# Altium schematic sheet filtering-optical.SchDoc: FILTERING-OPTICAL
size A4; DrawnBy: Dylan Vogel; Organization: UTAT SS; DocumentNumber: 5; Revision: 1; SheetNumber: 5; SheetTotal: 7
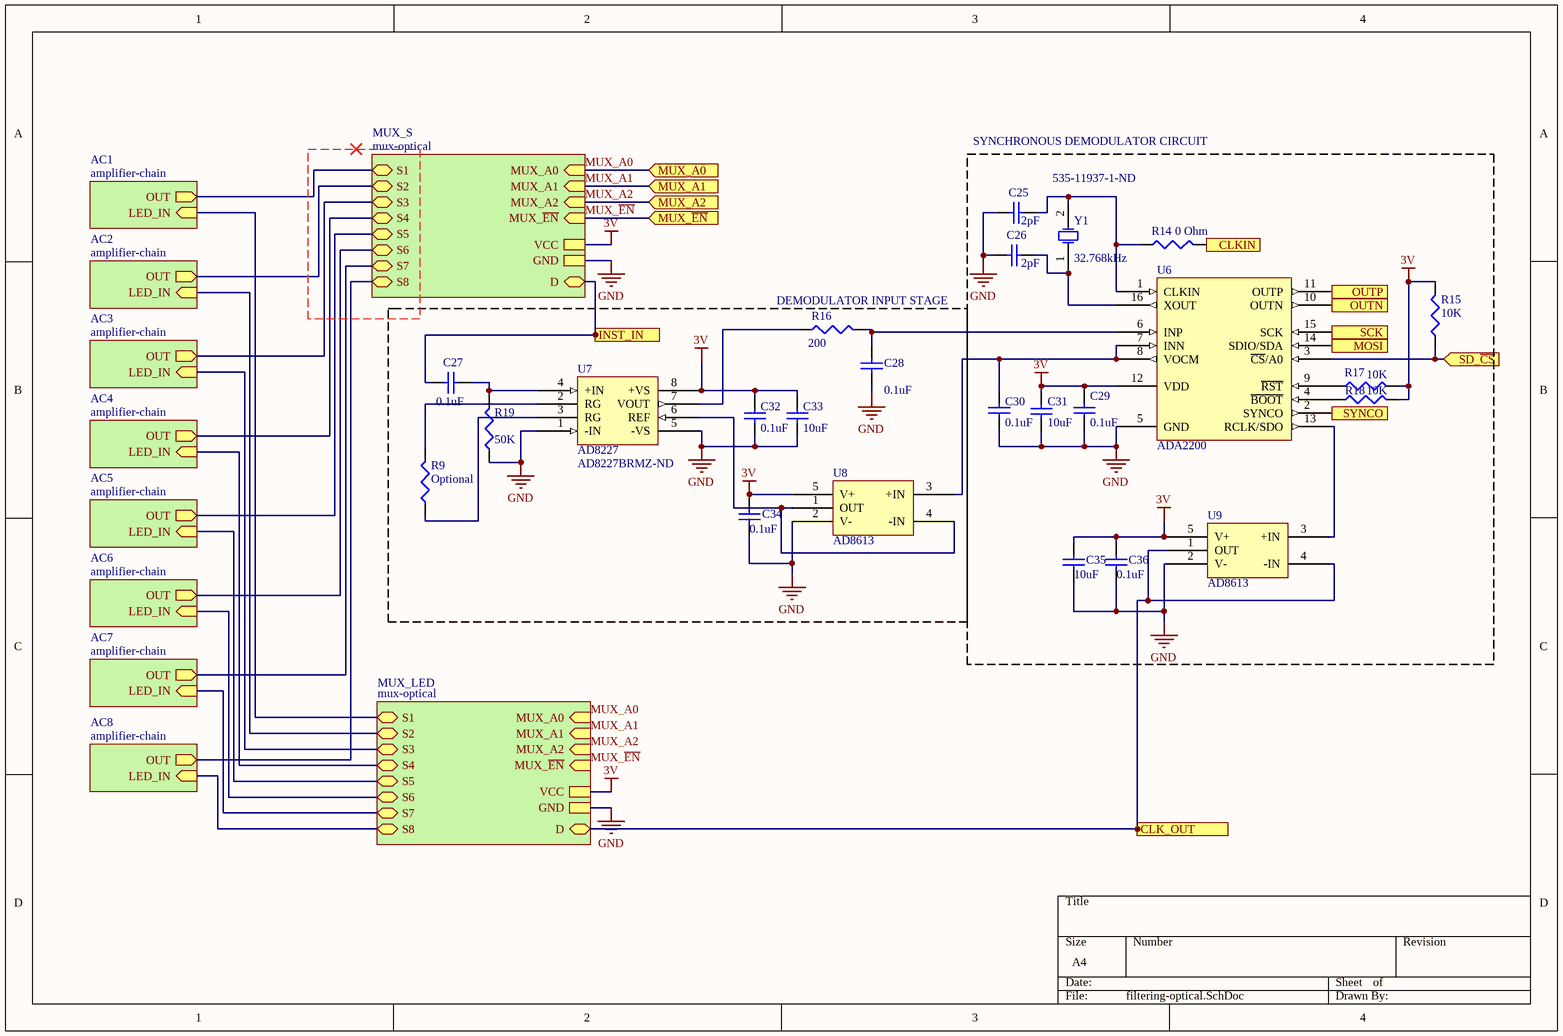
[diagram p0: filtering-optical.SchDoc]

## Parts
C25  2pF  [0402]
C26  2pF  [0402]
C27  0.1uF  [0402]
C28  0.1uF  [0402]
C29  0.1uF  [0402]
C30  0.1uF  [0402]
C31  10uF  [1608[0603]]
C32  0.1uF  [0402]
C33  10uF  [1608[0603]]
C34  0.1uF  [0402]
C35  10uF  [1608[0603]]
C36  0.1uF  [0402]
R9  Optional  [0402]
R14  0 Ohm  [0402]
R15  10K  [0402]
R16  200  [0402]
R17  10K  [0402]
R18  10K  [0402]
R19  50K  [0402]
U6  ADA2200  [SSOP16_N]
U7  AD8227  Supplier Part Number 1: AD8227BRMZ-ND  [SOP8-65P300X300-8N]
U8  AD8613  [SOP-65P200X125-5N]
U9  AD8613  [SOP-65P200X125-5N]
Y1  32.768kHz  Supplier Part Number: 535-11937-1-ND  [ABS07-120-32.768]

## Blocks framed on the sheet
SYNCHRONOUS DEMODULATOR CIRCUIT: C25 C26 C29-C31 C35 C36 R14 R15 R17 R18 U6 U9 Y1
DEMODULATOR INPUT STAGE: C27 C28 C32-C34 R9 R16 R19 U7 U8

## Sub-sheets
AC1 = amplifier-chain: OUT (out), LED_IN (in)
AC2 = amplifier-chain: OUT (out), LED_IN (in)
AC3 = amplifier-chain: OUT (out), LED_IN (in)
AC4 = amplifier-chain: OUT (out), LED_IN (in)
AC5 = amplifier-chain: OUT (out), LED_IN (in)
AC6 = amplifier-chain: OUT (out), LED_IN (in)
AC7 = amplifier-chain: OUT (out), LED_IN (in)
AC8 = amplifier-chain: OUT (out), LED_IN (in)
MUX_LED = mux-optical: MUX_A0 (in), MUX_A1 (in), MUX_A2 (in), MUX_~{EN} (in), VCC, GND, S1 (bidir), S2 (bidir), S3 (bidir), S4 (bidir), S5 (bidir), S6 (bidir), S7 (bidir), S8 (bidir), D (bidir)
MUX_S = mux-optical: MUX_A0 (in), MUX_A1 (in), MUX_A2 (in), MUX_~{EN} (in), VCC, GND, S1 (bidir), S2 (bidir), S3 (bidir), S4 (bidir), S5 (bidir), S6 (bidir), S7 (bidir), S8 (bidir), D (bidir)

## Ports
CLK_OUT (out), CLKIN (in), INST_IN (in), MOSI (in), MUX_A0 (in), MUX_A1 (in), MUX_A2 (in), MUX_~{EN} (in), OUTN (out), OUTP (out), SCK (in), SD_~{CS} (in), SYNCO (out)

## Nets
3V: C29.2 C31.1 C32.2 C33.2 C34.2 C35.2 C36.2 R15.2 R17.2 R18.2 U6.12(VDD) U7.8(+VS) U8.5(V+) U9.5(V+) ; sheet MUX_LED/VCC, sheet MUX_S/VCC
GND: C25.2 C26.2 C28.1 C29.1 C30.1 C31.2 C32.1 C33.1 C34.1 C35.1 C36.1 R19.1 U6.5(GND) U7.1(-IN) U7.5(-VS) U8.2(V-) U9.2(V-) ; sheet MUX_LED/GND, sheet MUX_S/GND
CLK_OUT: U9.1(OUT) U9.4(-IN) ; port CLK_OUT, sheet MUX_LED/D
CLKIN: R14.2 ; port CLKIN
INST_IN: C27.2 ; port INST_IN, sheet MUX_S/D
MOSI: U6.14(SDIO/SDA) ; port MOSI
MUX_A0: port MUX_A0, sheet MUX_LED/MUX_A0, sheet MUX_S/MUX_A0
MUX_A1: port MUX_A1, sheet MUX_LED/MUX_A1, sheet MUX_S/MUX_A1
MUX_A2: port MUX_A2, sheet MUX_LED/MUX_A2, sheet MUX_S/MUX_A2
MUX_~{EN}: port MUX_~{EN}, sheet MUX_LED/MUX_~{EN}, sheet MUX_S/MUX_~{EN}
OUTN: U6.10(OUTN) ; port OUTN
OUTP: U6.11(OUTP) ; port OUTP
SCK: U6.15(SCK) ; port SCK
SD_~{CS}: R15.1 U6.3(~{CS}/A0) ; port SD_~{CS}
SYNCO: U6.2(SYNCO) ; port SYNCO
NetC25_1: C25.1 R14.1 U6.1(CLKIN) Y1.2(OSC2)
NetC26_1: C26.1 U6.16(XOUT) Y1.1(OSC1)
NetC27_1: C27.1 R19.2 U7.4(+IN)
NetC28_2: C28.2 R16.2 U6.6(INP)
NetC30_2: C30.2 U6.7(INN) U6.8(VOCM) U8.3(+IN)
NetR9_1: R9.1 U7.3(RG)
NetR9_2: R9.2 U7.2(RG)
NetR16_1: R16.1 U7.7(VOUT)
NetR17_1: R17.1 U6.9(~{RST})
NetR18_1: R18.1 U6.4(~{BOOT})
NetU6_13: U6.13(RCLK/SDO) U9.3(+IN)
NetU7_6: U7.6(REF) U8.1(OUT) U8.4(-IN)
(unnamed): sheet AC1/OUT, sheet MUX_S/S1
(unnamed): sheet AC1/LED_IN, sheet MUX_LED/S1
(unnamed): sheet AC2/OUT, sheet MUX_S/S2
(unnamed): sheet AC2/LED_IN, sheet MUX_LED/S2
(unnamed): sheet AC3/OUT, sheet MUX_S/S3
(unnamed): sheet AC3/LED_IN, sheet MUX_LED/S3
(unnamed): sheet AC4/OUT, sheet MUX_S/S4
(unnamed): sheet AC4/LED_IN, sheet MUX_LED/S4
(unnamed): sheet AC5/OUT, sheet MUX_S/S5
(unnamed): sheet AC5/LED_IN, sheet MUX_LED/S5
(unnamed): sheet AC6/OUT, sheet MUX_S/S6
(unnamed): sheet AC6/LED_IN, sheet MUX_LED/S6
(unnamed): sheet AC7/OUT, sheet MUX_S/S7
(unnamed): sheet AC7/LED_IN, sheet MUX_LED/S7
(unnamed): sheet AC8/OUT, sheet MUX_S/S8
(unnamed): sheet AC8/LED_IN, sheet MUX_LED/S8

## Notes on the sheet
- Cut-off frequency is 32 Hz, minimal effect on phase of 500 Hz signal. AC coupling for instrumentation amplifier input.
- (near U7) No resistor on RG sets 5x gain on amplifier.

## Library data of the parts
C25-C36 = Cap Semi: Capacitor (Semiconductor SIM Model); Published: 8-Jun-2000; LatestRevisionDate: 29-May-2009; LatestRevisionNote: IPC-7351 Footprint Added.; PackageReference: C1206; Publisher: Altium Limited; PackageDescription: Chip Capacitor; Supplier: Digi-Key
  C25 C26: Value: 2pF
  C27-C30 C32 C34 C36: Value: 0.1uF
  C31 C33 C35: Value: 10uF
R9 = Res3: Optional resistor to set gain on inst amp.; Published: 8-Jun-2000; LatestRevisionDate: 29-May-2009; LatestRevisionNote: IPC-7351 Footprint Added.; PackageReference: J1-0603; Publisher: Altium Limited; PackageDescription: Chip Resistor
R14-R19 = Res3: Resistor; Published: 8-Jun-2000; LatestRevisionDate: 29-May-2009; LatestRevisionNote: IPC-7351 Footprint Added.; PackageReference: J1-0603; Publisher: Altium Limited; PackageDescription: Chip Resistor; Supplier: Digi-Key
  R14: Value: 0 Ohm
  R15 R17 R18: Value: 10K
  R16: Value: 200
  R19: Value: 50K
U6 = ADA2200: Synchronous demodulator and configurable analog filter.; Supplier: Digi-Key
U7 = AD8227: Rail-to-rail instrumentation amplifier. Can operate on single supply.; Supplier 1: Digi-Key; Supplier: Digi-Key
U8 U9 = AD8613: Low power, low noise rail-to-rail op-amp.; Supplier: Digi-Key
Y1 = XTAL: Crystal Oscillator; Published: 8-Jun-2000; LatestRevisionDate: 17-Jul-2002; LatestRevisionNote: Re-released for DXP Platform.; PackageReference: R38; Publisher: Altium Limited; PackageDescription: Crystal, Thru-Hole; 2 Leads; Body 3.1 x 8.2 mm (Dia.xH); Supplier: Digi-Key